# EAGLE design bomfly_jst (EAGLE 5.07)
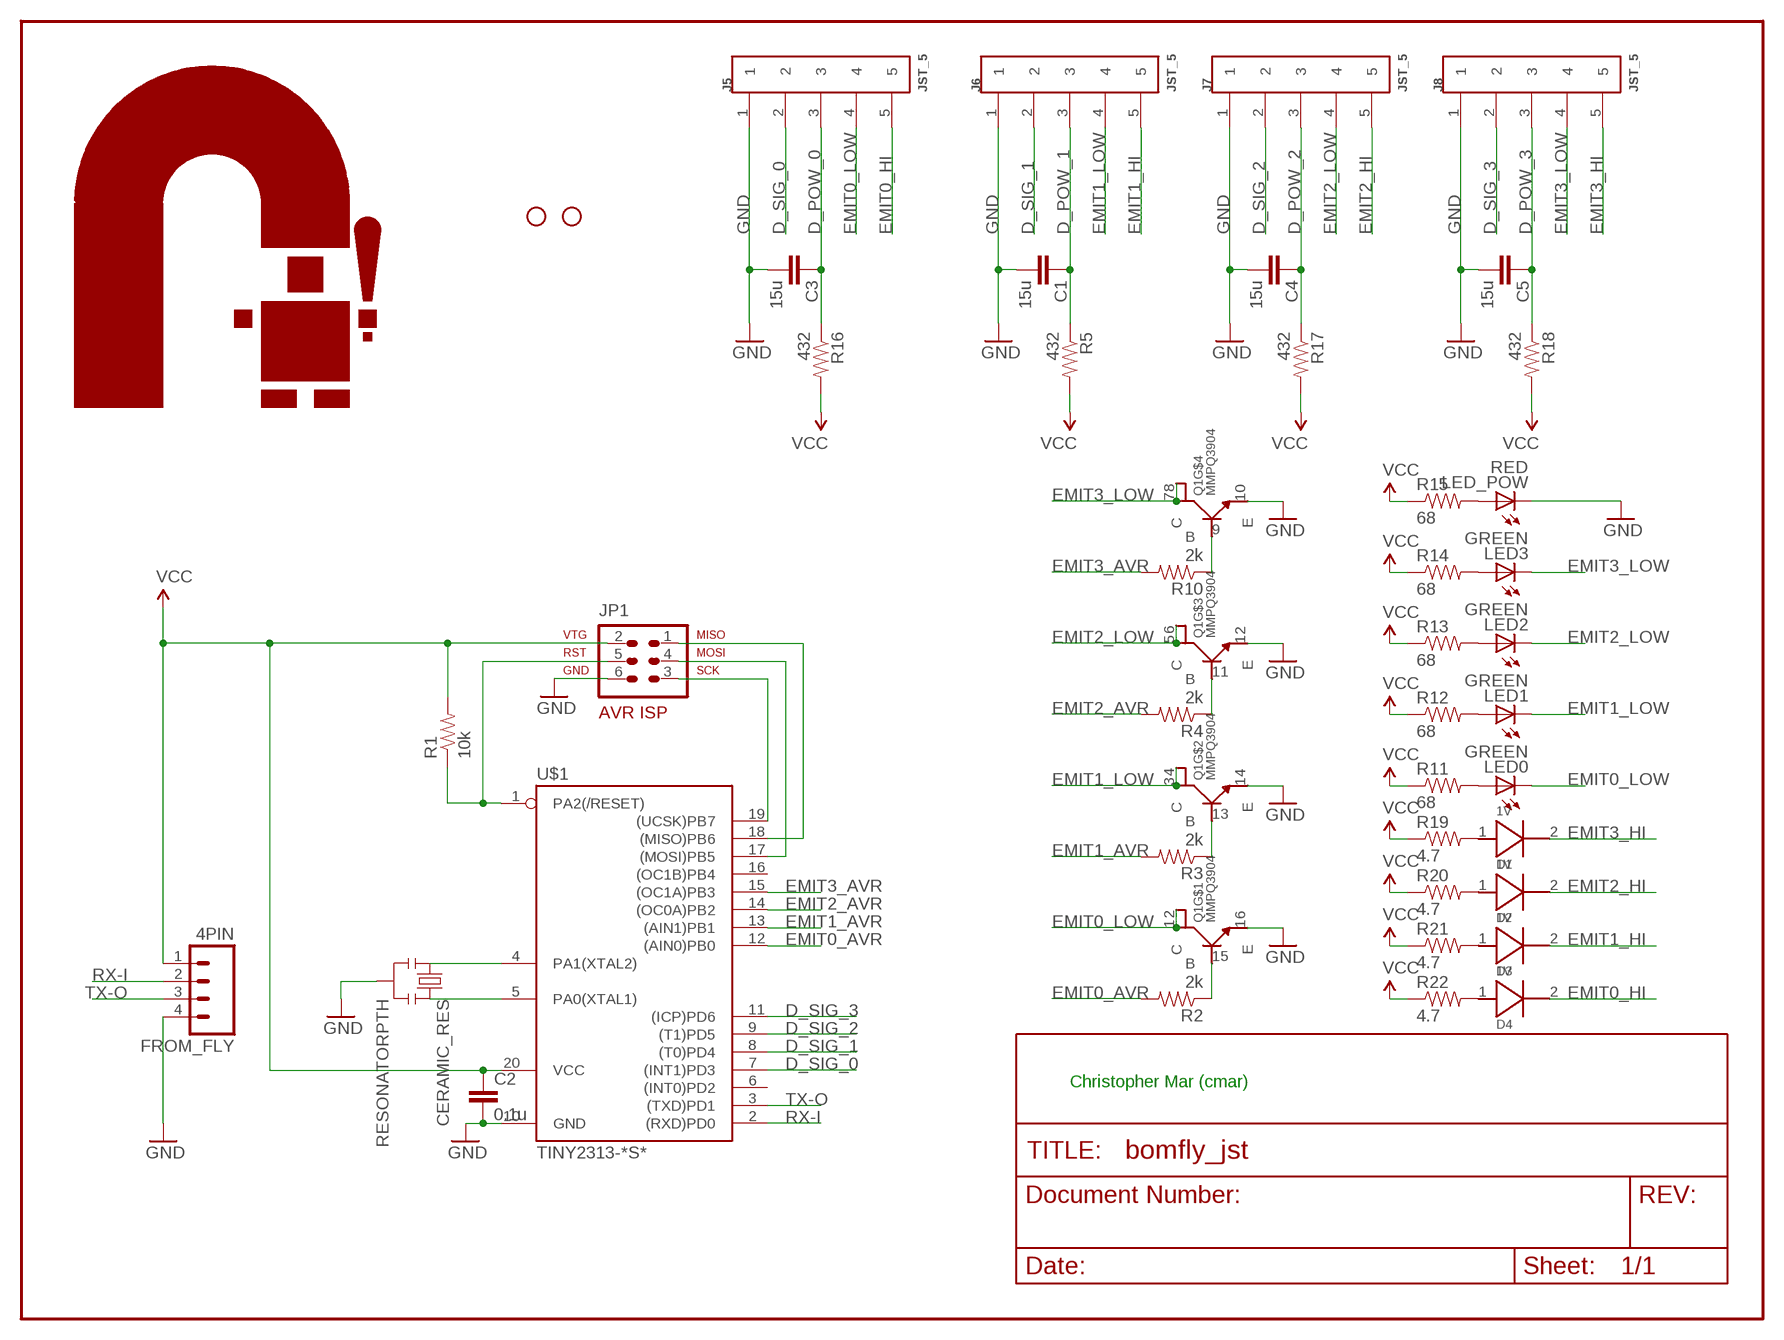
[diagram p0: schematic, sheet 1]

## Parts
C1  15u  CAP0603-CAP  [0603-CAP]
C2  0.1u  CAP0603-CAP  [0603-CAP]
C3  15u  CAP0603-CAP  [0603-CAP]
C4  15u  CAP0603-CAP  [0603-CAP]
C5  15u  CAP0603-CAP  [0603-CAP]
CERAMIC_RES  RESONATORPTH  [RESONATOR-PTH]
D1  1V  DIODE  [0603]
D2  1V  DIODE  [0603]
D3  1V  DIODE  [0603]
D4  1V  DIODE  [0603]
FROM_FLY  4PIN  M04PTH  [1X04]
J5  JST_5  [JST_ZH_RA_5]
J6  JST_5  [JST_ZH_RA_5]
J7  JST_5  [JST_ZH_RA_5]
J8  JST_5  [JST_ZH_RA_5]
JP1  AVR-ISP-6  [AVR-ISP-6]
JP2  STAND-OFF  [STAND-OFF]
JP5  STAND-OFF  [STAND-OFF]
LED0  GREEN  LED0603  [LED-0603]
LED1  GREEN  LED0603  [LED-0603]
LED2  GREEN  LED0603  [LED-0603]
LED3  GREEN  LED0603  [LED-0603]
LED_POW  RED  LED0603  [LED-0603]
Q1  MMPQ3904  [16-SOIC]
R1  10k  RESISTOR0603-RES  [0603-RES]
R2  2k  RESISTOR0603-RES  [0603-RES]
R3  2k  RESISTOR0603-RES  [0603-RES]
R4  2k  RESISTOR0603-RES  [0603-RES]
R5  432  RESISTOR0603-RES  [0603-RES]
R10  2k  RESISTOR0603-RES  [0603-RES]
R11  68  RESISTOR0603-RES  [0603-RES]
R12  68  RESISTOR0603-RES  [0603-RES]
R13  68  RESISTOR0603-RES  [0603-RES]
R14  68  RESISTOR0603-RES  [0603-RES]
R15  68  RESISTOR0603-RES  [0603-RES]
R16  432  RESISTOR0603-RES  [0603-RES]
R17  432  RESISTOR0603-RES  [0603-RES]
R18  432  RESISTOR0603-RES  [0603-RES]
R19  4.7  RESISTOR1206  [1206]
R20  4.7  RESISTOR1206  [1206]
R21  4.7  RESISTOR1206  [1206]
R22  4.7  RESISTOR1206  [1206]
U$1  TINY2313-*S*  [SO20L$]
U$3  ROBOLOGOSILKSCREEN  [RCLOGO]

## Nets
D_POW_0: C3.1 J5.3 R16.1
D_POW_1: C1.1 J6.3 R5.1
D_POW_2: C4.1 J7.3 R17.1
D_POW_3: C5.1 J8.3 R18.1
D_SIG_0: J5.2 U$1.7((INT1)PD3)
D_SIG_1: J6.2 U$1.8((T0)PD4)
D_SIG_2: J7.2 U$1.9((T1)PD5)
D_SIG_3: J8.2 U$1.11((ICP)PD6)
EMIT0_AVR: R2.2 U$1.12((AIN0)PB0)
EMIT0_HI: D4.2 J5.5
EMIT0_LOW: J5.4 LED0.C Q1.1(C) Q1.2(C1)
EMIT1_AVR: R3.2 U$1.13((AIN1)PB1)
EMIT1_HI: D3.2 J6.5
EMIT1_LOW: J6.4 LED1.C Q1.3(C) Q1.4(C1)
EMIT2_AVR: R4.2 U$1.14((OC0A)PB2)
EMIT2_HI: D2.2 J7.5
EMIT2_LOW: J7.4 LED2.C Q1.5(C) Q1.6(C1)
EMIT3_AVR: R10.2 U$1.15((OC1A)PB3)
EMIT3_HI: D1.2 J8.5
EMIT3_LOW: J8.4 LED3.C Q1.7(C) Q1.8(C1)
GND: C1.2 C2.2 C3.2 C4.2 C5.2 CERAMIC_RES.2 FROM_FLY.4 J5.1 J6.1 J7.1 J8.1 JP1.6 LED_POW.C Q1.10(E) Q1.12(E) Q1.14(E) Q1.16(E) U$1.10(GND)
MISO: JP1.1 U$1.18((MISO)PB6)
MOSI: JP1.4 U$1.17((MOSI)PB5)
N$5: D1.1 R19.2
N$6: D2.1 R20.2
N$7: D3.1 R21.2
N$8: D4.1 R22.2
N$11: Q1.15(B) R2.1
N$12: Q1.13(B) R3.1
N$13: Q1.11(B) R4.1
N$14: Q1.9(B) R10.1
N$20: LED0.A R11.2
N$21: LED1.A R12.2
N$22: LED2.A R13.2
N$23: LED3.A R14.2
N$24: LED_POW.A R15.2
RST: JP1.5 R1.1 U$1.1(PA2(/RESET))
RX-I: FROM_FLY.2 U$1.2((RXD)PD0)
SCK: JP1.3 U$1.19((UCSK)PB7)
TX-O: FROM_FLY.3 U$1.3((TXD)PD1)
VCC: C2.1 FROM_FLY.1 JP1.2 R1.2 R5.2 R11.1 R12.1 R13.1 R14.1 R15.1 R16.2 R17.2 R18.2 R19.1 R20.1 R21.1 R22.1 U$1.20(VCC)
XTAL1: CERAMIC_RES.3 U$1.5(PA0(XTAL1))
XTAL2: CERAMIC_RES.1 U$1.4(PA1(XTAL2))
Unconnected: U$1.6((INT0)PD2) U$1.16((OC1B)PB4)

## Notes on the sheet
- Christopher Mar (cmar)

## Library data of the parts
C1-C5 = SparkFun:CAP: Capacitor Standard 0603 ceramic capacitor, and 0.1" leaded capacitor.
CERAMIC_RES = SparkFun:RESONATOR: Resonator Small SMD resonator. This is the itty bitty 10/20MHz resonators with built in caps. CSTCE10M0G55 and CSTCE20M0V53. Footprint has been reviewed closely but hasn't been tested yet.
D1-D4 = kwoo:DIODE
FROM_FLY = SparkFun:M04: Header 4 Standard 4-pin 0.1" header. Use with straight break away headers (SKU : PRT-00116), right angle break away headers (PRT-00553), swiss pins (PRT-00743), machine pins (PRT-00117), and female headers (PRT-00115). Molex polarized connector foot print use with SKU : PRT-08231 with associated crimp pins and housings.
J5-J8 = kwoo:JST_5
JP1 = avr-6:AVR-ISP-6: AVR ISP-6 Serial Programming Header
JP2 JP5 = SparkFun:STAND-OFF: Stand Off This is the mechanical footprint for a #4 phillips button head screw. Use the keepout ring to avoid running the screw head into surrounding components. SKU : PRT-00447
LED0 LED1-LED3 LED_POW = SparkFun:LED: LEDs Standard schematic elements and footprints for 5mm, 3mm, 1206, and 0603 sized LEDs. 5mm - Spark Fun Electronics SKU : COM-00529 (and others)
Q1 = kwoo:MMPQ3904
R1-R5 R10-R22 = SparkFun:RESISTOR: Resistor Basic schematic elements and footprints for 0603, 1206, and PTH 1/10th watt (small) resistors.
U$1 = avr-6:TINY2313*: Atmel Tiny2313 2K Flash, 128 bytes EEPROM, 128 bytes RAM
U$3 = rc:ROBOLOGO

## Board
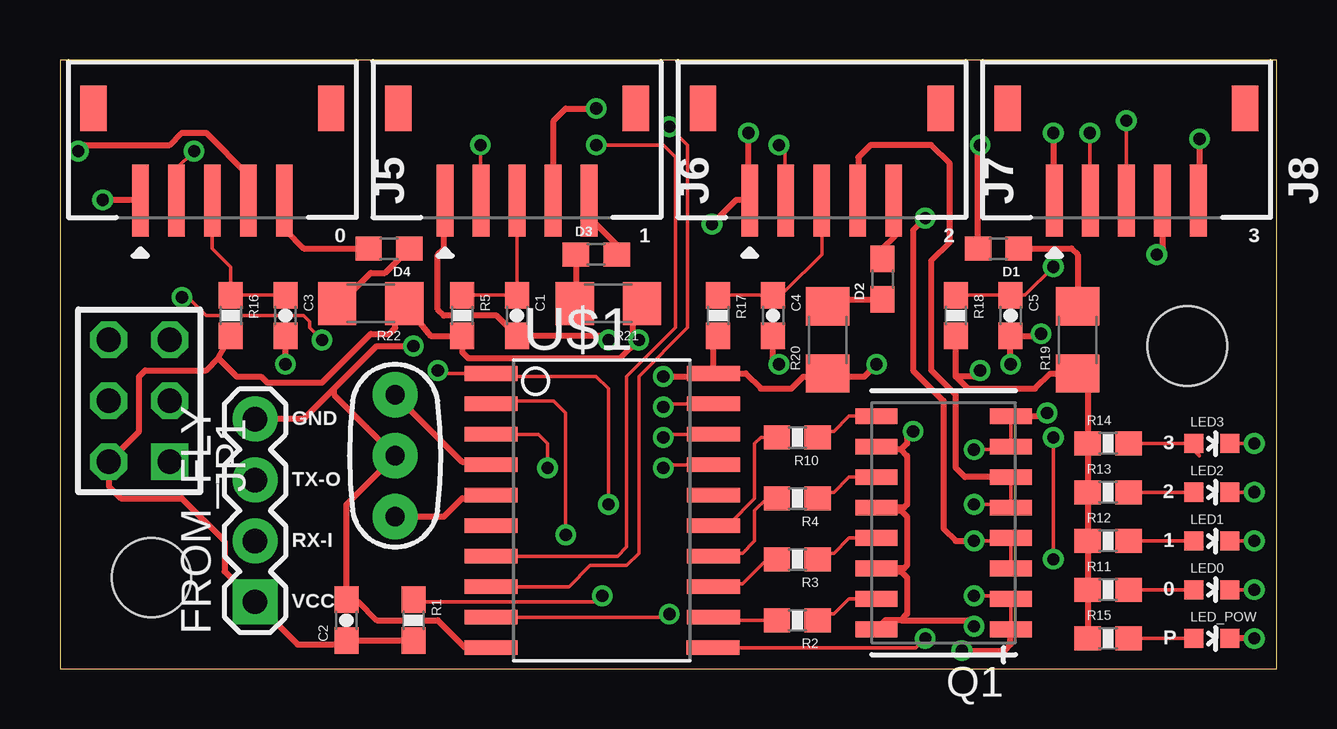
[diagram p1: board, top side]
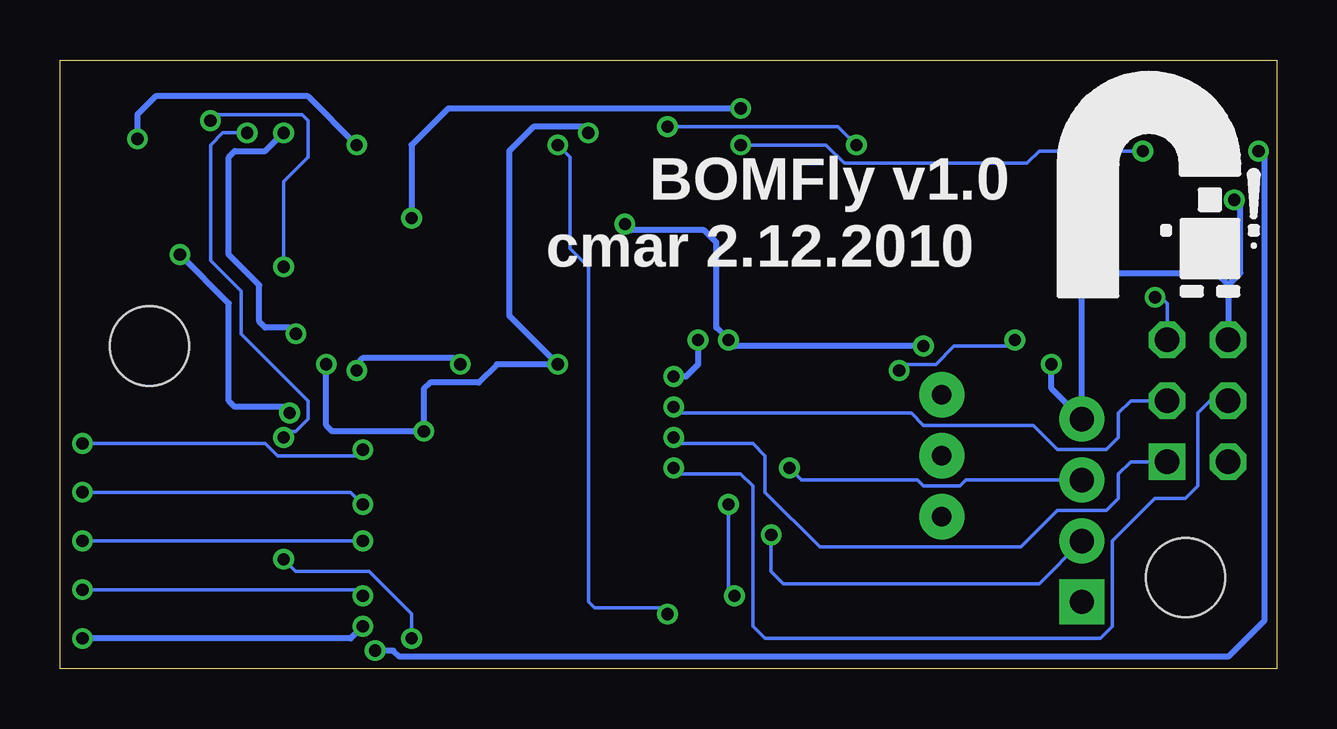
[diagram p2: board, bottom side, seen from below]

Size 50.72 x 25.39 mm. Coordinates in mm from the lower left corner, seen from the top.
Outline: 0,0 50.72,0 50.72,25.39 0,25.39 0,0
Copper layers (1*16): Top 0.035mm / dielectric 1.5mm / Bottom 0.035mm
Design rules "barebonespcb": minimum track width 6mil, minimum drill 15mil, track to track 6mil, track to pad 6mil, pad to pad 6mil, via to via 6mil, smd to smd 6mil, copper to edge 10mil, drill to drill 8mil, minimum pad ring 7mil, minimum via ring 7mil, stop-mask expansion 4mil, vias tented up to drill 0mil, thermal gap 10mil

### Footprints (pad centres in the part's own frame; a part is rotated, then mirrored left to right if it is on the bottom)
0603-CAP = smd 1.1 x 1: 1 -0.85,0; 2 0.85,0
RESONATOR-PTH = drill 0.8 pad 1.88 round: 1 -2.54,0; 2 0,0; 3 2.54,0
0603 = smd 1.1 x 1: 1 -0.85,0; 2 0.85,0
1X04 = drill 1.016 pad 1.88 square: 1 0,0 | drill 1.016 pad 1.88 round: 2 2.54,0; 3 5.08,0; 4 7.62,0
JST_ZH_RA_5 = smd 0.7 x 3: 1 -3,-3.85; 2 -1.5,-3.85; 3 0,-3.85; 4 1.5,-3.85; 5 3,-3.85 | smd 1.1 x 1.9: CASE1 -4.95,0; CASE2 4.95,0
AVR-ISP-6 = drill 1.016 square: 1 -2.54,-1.27 | drill 1.016 octagon: 2 -2.54,1.27; 3 0,-1.27; 4 0,1.27; 5 2.54,-1.27; 6 2.54,1.27
STAND-OFF = hole 3.302: 0,0
LED-0603 = smd 0.8 x 0.8: A 0,-0.75; C 0,0.75
16-SOIC = smd 0.65 x 1.75: 1 -4.445,-2.8; 2 -3.175,-2.8; 3 -1.905,-2.8; 4 -0.635,-2.8; 5 0.635,-2.8; 6 1.905,-2.8; 7 3.175,-2.8; 8 4.445,-2.8; 9 4.445,2.8; 10 3.175,2.8; 11 1.905,2.8; 12 0.635,2.8; 13 -0.635,2.8; 14 -1.905,2.8; 15 -3.175,2.8; 16 -4.445,2.8
0603-RES = smd 1.1 x 1: 1 -0.85,0; 2 0.85,0
1206 = smd 1.6 x 1.8: 1 -1.4,0; 2 1.4,0
SO20L$ = smd 0.61 x 2.21: 1 -5.715,-4.636; 2 -4.445,-4.636; 3 -3.175,-4.636; 4 -1.905,-4.636; 5 -0.635,-4.636; 6 0.635,-4.636; 7 1.905,-4.636; 8 3.175,-4.636; 9 4.445,-4.636; 10 5.715,-4.636; 11 5.715,4.61; 12 4.445,4.636; 13 3.175,4.636; 14 1.905,4.636; 15 0.635,4.636; 16 -0.635,4.636; 17 -1.905,4.636; 18 -3.175,4.636; 19 -4.445,4.636; 20 -5.715,4.636

### Placement (x,y rotation side)
C1  19.05,14.73 270 top
C2  11.94,2.03 90 top
C3  9.4,14.73 270 top
C4  29.72,14.73 270 top
C5  39.62,14.73 270 top
CERAMIC_RES  13.97,8.89 270 top
D1  39.12,17.53 180 top
D2  34.29,16.26 90 top
D3  22.35,17.27 0 top
D4  13.72,17.53 180 top
FROM_FLY  8.13,2.79 90 top
J5  6.35,23.37 0 top
J6  19.05,23.37 0 top
J7  31.75,23.37 0 top
J8  44.45,23.37 0 top
JP1  3.3,11.18 90 top
JP2  3.81,3.81 0 top
JP5  46.99,13.46 0 top
LED0  48.01,3.3 270 top
LED1  48.01,5.33 270 top
LED2  48.01,7.37 270 top
LED3  48.01,9.4 270 top
LED_POW  48.01,1.27 270 top
Q1  36.83,6.1 90 top
R1  14.73,2.03 270 top
R2  30.73,2.03 180 top
R3  30.73,4.57 180 top
R4  30.73,7.11 180 top
R5  16.76,14.73 270 top
R10  30.73,9.65 180 top
R11  43.69,3.3 0 top
R12  43.69,5.33 0 top
R13  43.69,7.37 0 top
R14  43.69,9.4 0 top
R15  43.69,1.27 0 top
R16  7.11,14.73 270 top
R17  27.43,14.73 270 top
R18  37.34,14.73 270 top
R19  42.42,13.72 90 top
R20  32,13.72 90 top
R21  22.86,15.24 180 top
R22  12.95,15.24 180 top
U$1  22.61,6.6 270 top
U$3  5.33,18.54 0 bottom

### Tracks (layer width: path | path; a pad name or v marks a point on that pad's centre or on a via)
D_POW_0
  Top 0.152: C3.1 R16.1 7.11,16.76 6.35,17.53 J5.3
D_POW_1
  Top 0.152: R5.1 C1.1 J6.3
D_POW_2
  Top 0.152: R17.1 C4.1 29.88,15.75 30.23,15.75 31.75,17.27 J7.3
D_POW_3  (via drill 0.51)
  Top 0.152: R18.1 C5.1 40.22,15.58 v41.4,16.76 | v44.45,22.86 J8.3
  Bottom 0.152: v41.4,16.76 41.4,20.32 40.39,21.34 40.39,22.86 40.64,23.11 44.2,23.11 v44.45,22.86
D_SIG_0  (via drill 0.51)
  Top 0.152: U$1.7 23.24,4.7 23.62,5.08 23.62,12.19 25.65,14.22 25.65,21.34 25.15,21.84 v22.35,21.84 | J5.2 4.83,19.54 4.83,20.83 v5.59,21.59
  Bottom 0.152: v5.59,21.59 9.91,21.59 10.41,21.08 18.03,21.08 18.8,21.84 v22.35,21.84
D_SIG_1  (via drill 0.51)
  Top 0.152: U$1.8 21.21,3.43 22.1,4.32 23.62,4.32 24.13,4.83 24.13,12.19 26.16,14.22 26.16,21.84 v25.4,22.61 | v17.53,21.84 17.53,19.54 J6.2
  Bottom 0.152: v25.4,22.61 18.29,22.61 v17.53,21.84
D_SIG_2  (via drill 0.51, 0.51 pad 0.76)
  Top 0.152: U$1.9 25.27,2.16 v25.4,2.29 | 30.23,18.29 30.23,19.49 J7.2 30.23,19.54 30.23,21.59 v29.97,21.84
  Bottom 0.152: v25.4,2.29 25.65,2.54 28.45,2.54 28.7,2.79 28.7,16.76 29.46,17.53 29.46,21.34 v29.97,21.84
D_SIG_3  (via drill 0.51)
  Top 0.152: U$1.11 35.69,0.89 v36.07,1.27 | v41.4,4.57 v41.4,9.65 | v42.93,22.35 42.93,19.54 J8.2
  Bottom 0.152: v36.07,1.27 36.07,2.29 37.85,4.06 40.89,4.06 v41.4,4.57 | v41.4,9.65 41.15,9.91 40.89,9.91 40.39,10.41 40.39,11.18 43.18,13.97 43.18,15.75 44.45,17.02 44.45,21.84 43.94,22.35 v42.93,22.35
EMIT0_AVR
  Top 0.152: R2.2 27.37,2.03 U$1.12
EMIT0_HI
  Top 0.254: D4.2 10.16,17.53 9.4,18.29 9.4,19.47 J5.5
EMIT0_LOW  (via drill 0.51, 0.51 pad 0.76)
  Top 0.152: Q1.1 Q1.2 39.5,3.05 v38.1,3.05 | v49.78,3.3 LED0.C
  Top 0.254: v37.59,0.76 39.37,0.76 39.62,1.02 Q1.1 | v0.76,21.59 1.02,21.84 4.57,21.84 5.08,22.35 6.1,22.35 7.87,20.57 7.87,19.54 J5.4
  Bottom 0.152: v49.78,3.3 38.35,3.3 v38.1,3.05
  Bottom 0.254: v37.59,0.76 36.83,0.76 36.58,0.51 2.03,0.51 0.51,2.03 0.51,21.34 v0.76,21.59
EMIT1_AVR
  Top 0.152: R3.2 29.46,4.57 28.45,3.56 27.37,3.56 U$1.13
EMIT1_HI
  Top 0.254: D3.2 23.46,17.44 22.1,18.8 22.1,19.47 J6.5
EMIT1_LOW  (via drill 0.51, 0.51 pad 0.76)
  Top 0.152: Q1.3 Q1.4 39.5,5.33 v38.1,5.33 | v49.78,5.33 LED1.C
  Top 0.254: v38.1,5.33 37.34,5.33 36.83,5.84 36.83,11.18 35.56,12.45 35.56,18.29 v36.07,18.8 | v22.35,23.37 21.08,23.37 20.57,22.86 20.57,19.54 J6.4
  Bottom 0.152: v38.1,5.33 v49.78,5.33
  Bottom 0.254: v22.35,23.37 34.54,23.37 36.07,21.84 v36.07,18.8
EMIT2_AVR
  Top 0.152: R4.2 29.46,7.11 28.96,6.6 28.96,5.33 28.45,4.83 27.37,4.83 U$1.14
EMIT2_HI
  Top 0.254: D2.2 34.29,17.53 34.8,18.03 34.8,19.47 J7.5
EMIT2_LOW  (via drill 0.51, 0.51 pad 0.76)
  Top 0.152: Q1.6 Q1.5 39.5,6.86 v38.1,6.86 | v49.78,7.37 LED2.C
  Top 0.254: Q1.6 37.72,8 37.34,8.38 37.34,11.43 36.32,12.45 36.32,17.02 37.08,17.78 37.08,21.08 36.32,21.84 33.78,21.84 33.27,21.34 33.27,19.54 J7.4
  Bottom 0.152: 38.35,7.11 v38.1,6.86 38.61,7.37 v49.78,7.37
EMIT3_AVR
  Top 0.152: R10.2 29.21,9.65 28.96,9.4 28.96,7.11 27.94,6.1 27.37,6.1 U$1.15
EMIT3_HI  (via drill 0.51)
  Top 0.254: v47.5,22.1 47.5,19.57 J8.5 | D1.2 38.27,21.76 v38.35,21.84
  Bottom 0.254: 47.5,22.35 v47.5,22.1 47.5,23.11 46.74,23.88 40.39,23.88 v38.35,21.84
EMIT3_LOW  (via drill 0.51, 0.51 pad 0.76)
  Top 0.152: Q1.8 Q1.7 39.5,9.14 v38.1,9.14 | v49.78,9.4 LED3.C
  Top 0.254: Q1.8 41.02,10.54 v41.15,10.67 | v45.72,17.27 45.97,17.53 45.97,19.49 J8.4
  Bottom 0.152: v49.78,9.4 42.16,9.4 41.66,8.89 38.35,8.89 v38.1,9.14
  Bottom 0.254: v41.15,10.67 41.4,10.92 43.43,10.92 43.69,11.18 43.69,15.24 v45.72,17.27
GND  (via drill 0.51)
  Top 0.152: Q1.16 34.16,1.78
  Top 0.254: v38.1,1.78 37.85,2.03 35.05,2.03 | Q1.16 34.41,2.03 35.05,2.03 | 35.05,2.03 35.31,2.29 35.31,3.81 35.05,4.06 34.16,4.06 Q1.14 35.18,4.19 35.31,4.32 35.31,6.35 35.05,6.6 34.16,6.6 Q1.12 35.18,6.73 35.31,6.86 35.31,8.89 35.05,9.14 | 35.05,9.14 34.16,9.14 Q1.10 | v39.62,12.7 C5.2 40.81,13.88 v40.89,13.97 | v35.56,9.91 35.31,9.65 35.31,9.4 35.05,9.14 | C4.2 29.72,12.95 v29.97,12.7 | v22.86,13.72 22.69,13.88 C1.2 18.2,14.73 16,14.73 15.75,14.99 15.75,17.27 16,17.53 16,19.47 J6.1 | 3.3,18.8 3.3,19.47 J5.1 3.31,19.56 v1.78,19.56 | v28.7,22.35 28.7,19.57 J7.1 28.71,19.56 28.19,19.56 v27.18,18.54 | v41.4,22.35 41.4,19.57 J8.1 | v9.4,12.7 C3.2 | U$1.10 16.89,0.89 15.75,2.03 13.21,2.03 12.45,2.79 11.77,2.79 C2.2 11.94,6.86 CERAMIC_RES.2 11.43,11.43 11.43,11.68 | v49.78,1.27 LED_POW.C | v14.73,13.46 13.21,13.46 11.43,11.68 | 11.43,11.68 10.16,10.41 FROM_FLY.4
  Bottom 0.254: 2.03,16 JP1.6 | 2.03,16 2.54,16.51 7.87,16.51 8.13,16.26 FROM_FLY.4 9.4,11.68 v9.4,12.7 | v39.62,12.7 39.62,10.16 39.37,9.91 v35.56,9.91 35.56,11.68 35.31,11.94 33.27,11.94 32.51,12.7 v29.97,12.7 32,14.73 32,21.59 30.99,22.61 28.96,22.61 v28.7,22.35 | v40.89,13.97 41.15,14.22 42.16,14.22 42.42,14.48 42.42,16 43.69,17.27 43.69,21.34 43.43,21.59 42.16,21.59 v41.4,22.35 | 2.03,16 1.52,16.51 1.52,19.3 v1.78,19.56 | v27.18,18.54 26.92,18.29 23.88,18.29 23.37,17.78 23.37,14.22 v22.86,13.72 22.61,13.46 v14.73,13.46 | v49.78,1.27 38.61,1.27 v38.1,1.78
MISO  (via drill 0.51)
  Top 0.152: U$1.18 25.27,9.78 v25.15,9.65
  Bottom 0.152: v25.15,9.65 24.89,9.4 21.84,9.4 21.34,8.89 21.34,7.37 19.05,5.08 10.67,5.08 9.14,6.6 7.11,6.6 6.6,7.11 6.6,8.13 6.1,8.64 JP1.1
MOSI  (via drill 0.51)
  Top 0.152: U$1.17 25.27,8.51 v25.15,8.38
  Bottom 0.152: v25.15,8.38 24.89,8.13 22.35,8.13 21.84,7.62 21.84,1.78 21.34,1.27 7.37,1.27 6.86,1.78 6.86,5.33 5.08,7.11 3.81,7.11 3.3,7.62 3.3,10.67 2.79,11.18 JP1.4
N$5
  Top 0.254: R19.2 42.42,17.27 42.16,17.53 D1.1
N$6
  Top 0.254: 31.92,15.46 R20.2 32.29,15.41 D2.1
N$7
  Top 0.254: 21.76,15.54 R21.2 21.5,15.28 D3.1
N$8
  Top 0.254: R22.2 11.68,15.24 12.95,16.51 13.55,16.51 D4.1
N$11
  Top 0.152: Q1.15 32.89,2.92 32.26,2.29 31.84,2.29 R2.1
N$12
  Top 0.152: Q1.13 32.89,5.46 32.26,4.83 31.84,4.83 R3.1
N$13
  Top 0.152: Q1.11 32.89,8 32.26,7.37 31.84,7.37 R4.1
N$14
  Top 0.152: Q1.9 32.89,10.54 32.26,9.91 31.84,9.91 R10.1
N$20
  Top 0.152: LED0.A 47.24,3.56 46.99,3.3 R11.2
N$21
  Top 0.152: R12.2 LED1.A
N$22
  Top 0.152: LED2.A 47.24,7.11 46.99,7.37 R13.2
N$23
  Top 0.152: LED3.A 47.5,8.89 46.99,9.4 R14.2
N$24
  Top 0.152: R15.2 LED_POW.A
RST  (via drill 0.51)
  Top 0.152: v22.86,6.86 22.86,11.68 22.35,12.19 18.1,12.19 U$1.1 15.88,12.32 v15.75,12.45 | v10.92,13.72 10.41,14.22 10.41,14.48 10.16,14.73 6.1,14.73 5.33,15.49 v5.08,15.49 | v22.61,3.05 22.35,2.79 14.82,2.79 R1.1
  Bottom 0.152: 22.86,6.6 v22.86,6.86 22.86,3.3 v22.61,3.05 | v10.92,13.72 11.18,13.46 13.46,13.46 14.22,12.7 15.49,12.7 v15.75,12.45 | JP1.5 4.57,15.24 4.83,15.49 v5.08,15.49
RX-I  (via drill 0.51)
  Top 0.152: v21.08,5.59 21.08,10.67 20.57,11.18 18.1,11.18 U$1.2
  Bottom 0.152: v21.08,5.59 21.08,4.06 20.57,3.56 9.91,3.56 FROM_FLY.2
SCK  (via drill 0.51)
  Top 0.152: U$1.19 25.27,11.05 v25.15,10.92
  Bottom 0.152: JP1.3 6.1,11.18 6.6,10.67 6.6,9.65 7.11,9.14 9.14,9.14 10.16,10.16 14.73,10.16 15.24,10.67 24.89,10.67 v25.15,10.92
TX-O  (via drill 0.51)
  Top 0.152: U$1.3 19.94,9.78 20.32,9.4 v20.32,8.38
  Bottom 0.152: v20.32,8.38 19.81,7.87 14.99,7.87 14.73,7.62 13.21,7.62 12.95,7.87 FROM_FLY.3
VCC  (via drill 0.51)
  Top 0.254: 6.6,12.95 R16.2 | 6.6,12.95 7.37,12.19 8.38,12.19 8.64,11.94 10.92,11.94 12.95,13.97 13.72,13.97 13.97,14.22 13.97,15.11 R22.1 15.46,13.88 R5.2 16.76,13.21 17.02,12.95 23.37,12.95 v24.13,13.72 23.88,13.97 23.88,15.11 R21.1 | R15.1 R11.1 R12.1 R13.1 R14.1 42.84,11.9 R19.1 41.27,12.32 40.64,11.68 37.85,11.68 37.34,12.19 | 37.34,12.19 R18.2 | 37.34,12.19 38.1,12.19 v38.35,12.45 | v34.04,12.7 33.53,12.19 32.13,12.19 R20.1 | R20.1 32.38,12.19 | U$1.20 27.24,13.69 R17.2 | v25.15,12.19 27.11,12.19 U$1.20 | 6.6,12.95 6.1,12.45 3.56,12.45 3.3,12.19 3.3,9.91 JP1.2 2.03,7.62 2.54,7.11 5.08,7.11 6.86,5.33 6.86,4.06 FROM_FLY.1 9.91,1.02 11.52,1.02 C2.1 R1.2 | U$1.20 28.57,12.32 29.21,11.68 30.48,11.68 30.99,12.19 31.88,12.19 R20.1
  Bottom 0.254: v38.35,12.45 38.35,12.7 38.1,12.95 34.29,12.95 v34.04,12.7 | v24.13,13.72 24.13,12.7 24.64,12.19 v25.15,12.19
XTAL1
  Top 0.254: CERAMIC_RES.3 16,6.35 16.76,7.11 17.84,7.11 U$1.5
XTAL2
  Top 0.254: CERAMIC_RES.1 16.76,8.64 17.84,8.64 U$1.4

### Text on the board
tPlace: 0 | 1 | 2 | 3 | GND | 3 | TX-O | 2 | RX-I | 1 | VCC | 0 | P
bPlace: BOMFly v1.0 | cmar 2.12.2010